# EAGLE design ESP32 Extension Board v1.0 (EAGLE 6.4)
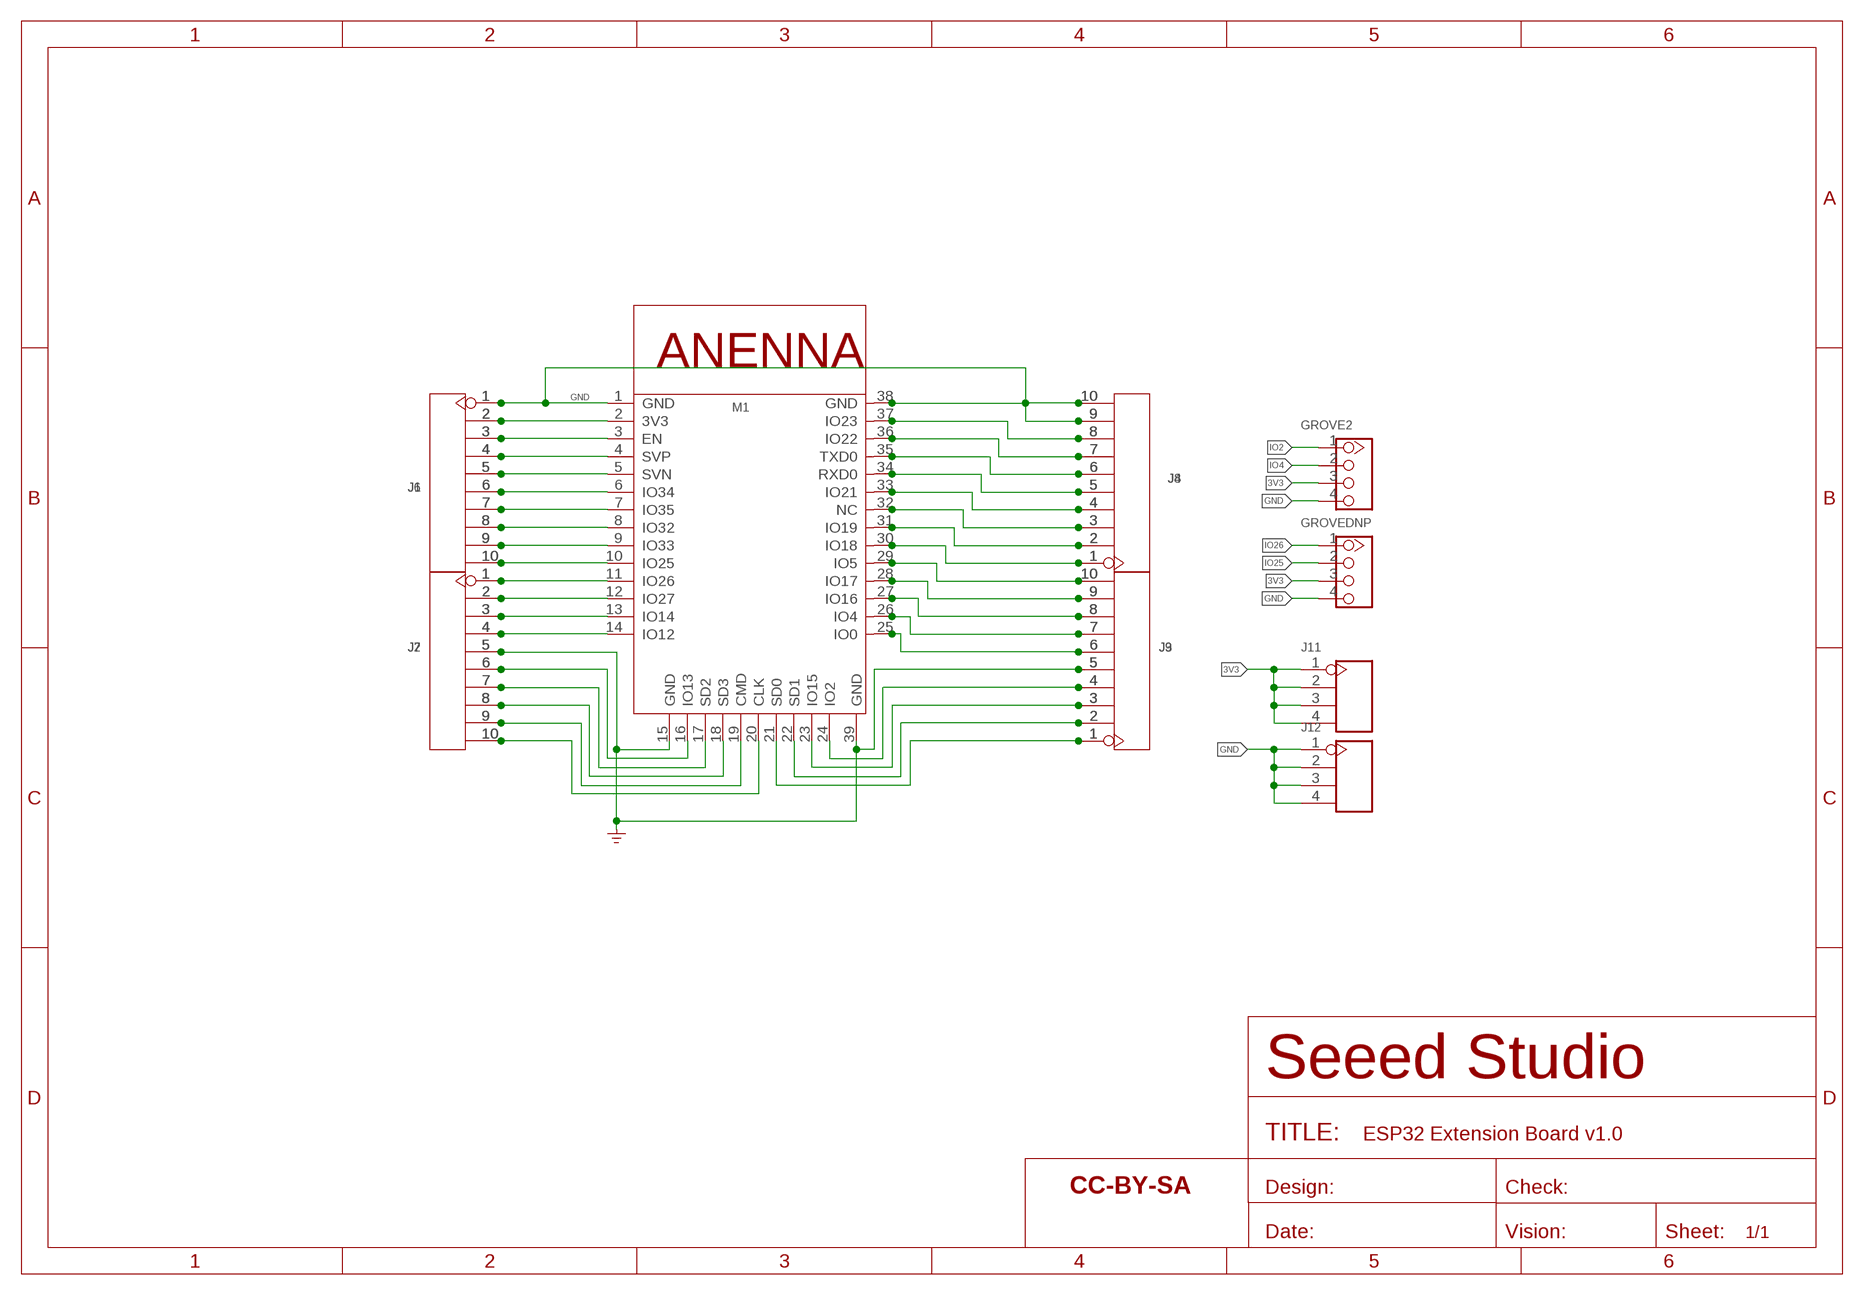
[diagram p0: schematic, sheet 1]

## Parts
FR2  SEEEDSTUDIO-OPEN-SCH-FRAME  [SEEEDSTUDIO-PCB-FRAME]
GROVE  DNP  GROVE-CONNECTOR-DIP-2.0  [HW4-2.0]
GROVE2  GROVE-CONNECTOR-DIP-2.0  [HW4-2.0]
J1  HEADER-10P-2.54  [H10-2.54]
J2  HEADER-10P-2.54  [H10-2.54]
J3  HEADER-10P-2.54  [H10-2.54]
J4  HEADER-10P-2.54  [H10-2.54]
J6  HEADER-10P-2.54  [H10-2.54]
J7  HEADER-10P-2.54  [H10-2.54]
J8  HEADER-10P-2.54  [H10-2.54]
J9  HEADER-10P-2.54  [H10-2.54]
J11  HEADER-4P-65/35MIL  [H4-2.54]
J12  HEADER-4P-65/35MIL  [H4-2.54]
M1  MODULE-WIFI-ESP-3212-38+1  [MODULE38P-1.3-18X25.5MM]

## Nets
3V3: GROVE2.3 GROVE.3 J1.2 J6.2 J11.1 J11.2 J11.3 J11.4 M1.2(3V3)
CLK: J2.10 J7.10 M1.20(CLK)
CMD: J2.9 J7.9 M1.19(CMD)
EN: J1.3 J6.3 M1.3(EN)
GND: GROVE2.4 GROVE.4 J1.1 J2.5 J3.5 J4.9 J4.10 J6.1 J7.5 J8.9 J8.10 J9.5 J12.1 J12.2 J12.3 J12.4 M1.1(GND) M1.15(GND) M1.38(GND) M1.39(GND) ; supply symbol labelled GND_POWER
IO0: J3.6 J9.6 M1.25(IO0)
IO2: GROVE2.1 J3.4 J9.4 M1.24(IO2)
IO4: GROVE2.2 J3.7 J9.7 M1.26(IO4)
IO5: J3.10 J9.10 M1.29(IO5)
IO12: J2.4 J7.4 M1.14(IO12)
IO13: J2.6 J7.6 M1.16(IO13)
IO14: J2.3 J7.3 M1.13(IO14)
IO15: J3.3 J9.3 M1.23(IO15)
IO16: J3.8 J9.8 M1.27(IO16)
IO17: J3.9 J9.9 M1.28(IO17)
IO18: J4.1 J8.1 M1.30(IO18)
IO19: J4.2 J8.2 M1.31(IO19)
IO21: J4.4 J8.4 M1.33(IO21)
IO22: J4.7 J8.7 M1.36(IO22)
IO23: J4.8 J8.8 M1.37(IO23)
IO25: GROVE.2 J1.10 J6.10 M1.10(IO25)
IO26: GROVE.1 J2.1 J7.1 M1.11(IO26)
IO27: J2.2 J7.2 M1.12(IO27)
IO32: J1.8 J6.8 M1.8(IO32)
IO33: J1.9 J6.9 M1.9(IO33)
IO34: J1.6 J6.6 M1.6(IO34)
IO35: J1.7 J6.7 M1.7(IO35)
NC: J4.3 J8.3 M1.32(NC)
RXD0: J4.5 J8.5 M1.34(RXD0)
SD0: J3.1 J9.1 M1.21(SD0)
SD1: J3.2 J9.2 M1.22(SD1)
SD2: J2.7 J7.7 M1.17(SD2)
SD3: J2.8 J7.8 M1.18(SD3)
SVN: J1.5 J6.5 M1.5(SVN)
SVP: J1.4 J6.4 M1.4(SVP)
TXD0: J4.6 J8.6 M1.35(TXD0)

## Library data of the parts
FR2 = moudle-new:SEEEDSTUDIO-OPEN-SCH-FRAME
GROVE GROVE2 = Connector-new:GROVE-CONNECTOR-DIP: 4P-2.0:320110033;4P-2.0-90D:320110034
J1-J4 J6-J9 = Connector-new:HEADER-10P
J11 J12 = Connector-new:HEADER-4P
M1 = template:MODULE-WIFI-ESP-3212

## Board
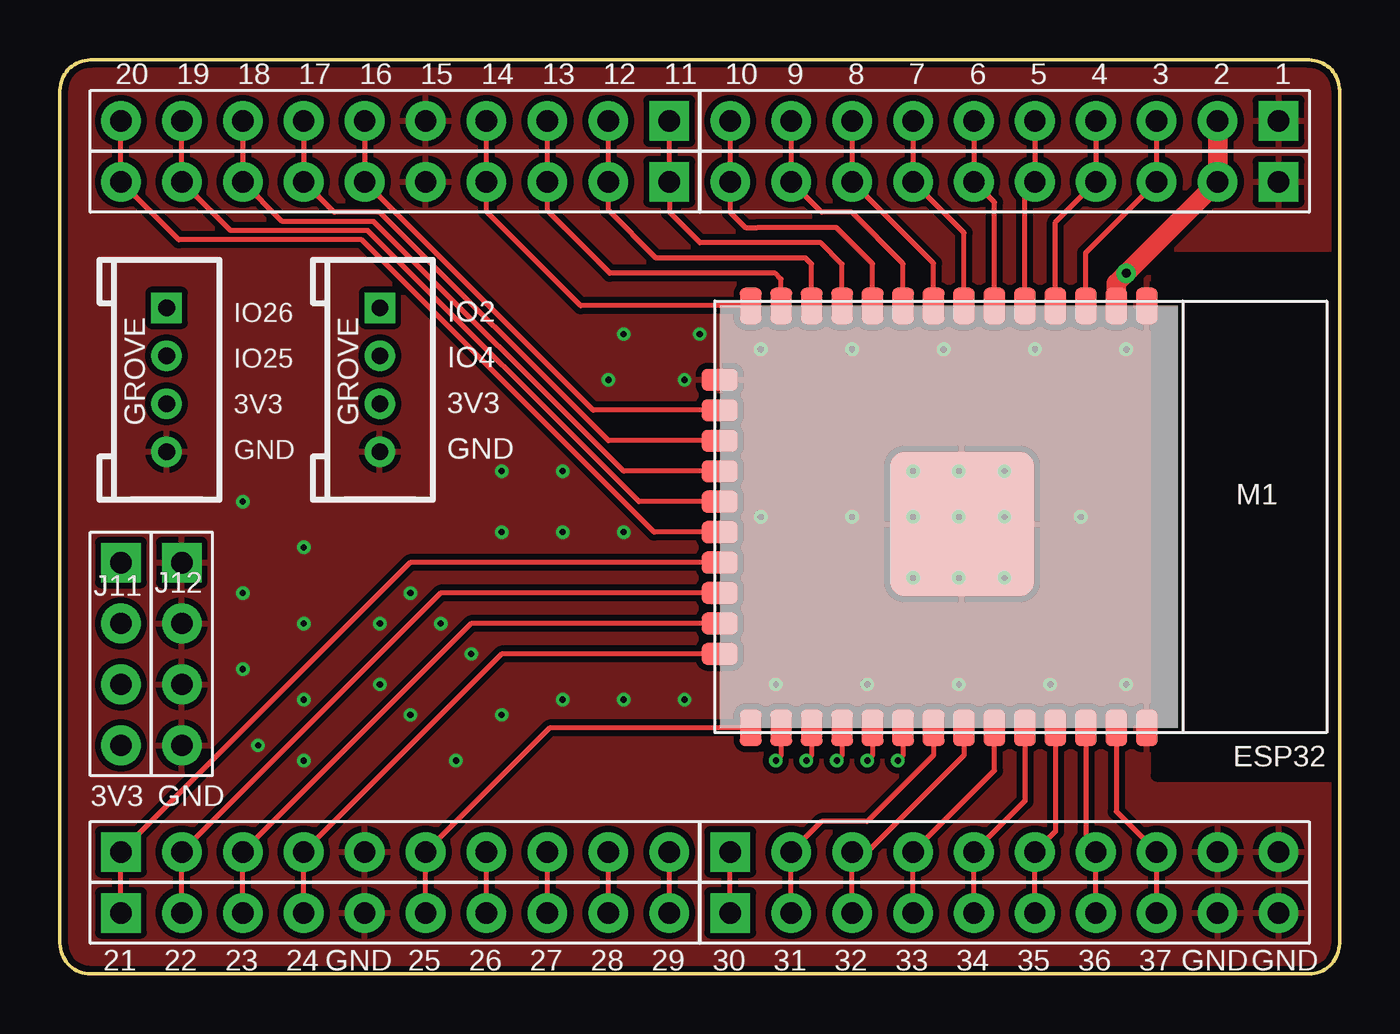
[diagram p1: board, top side]
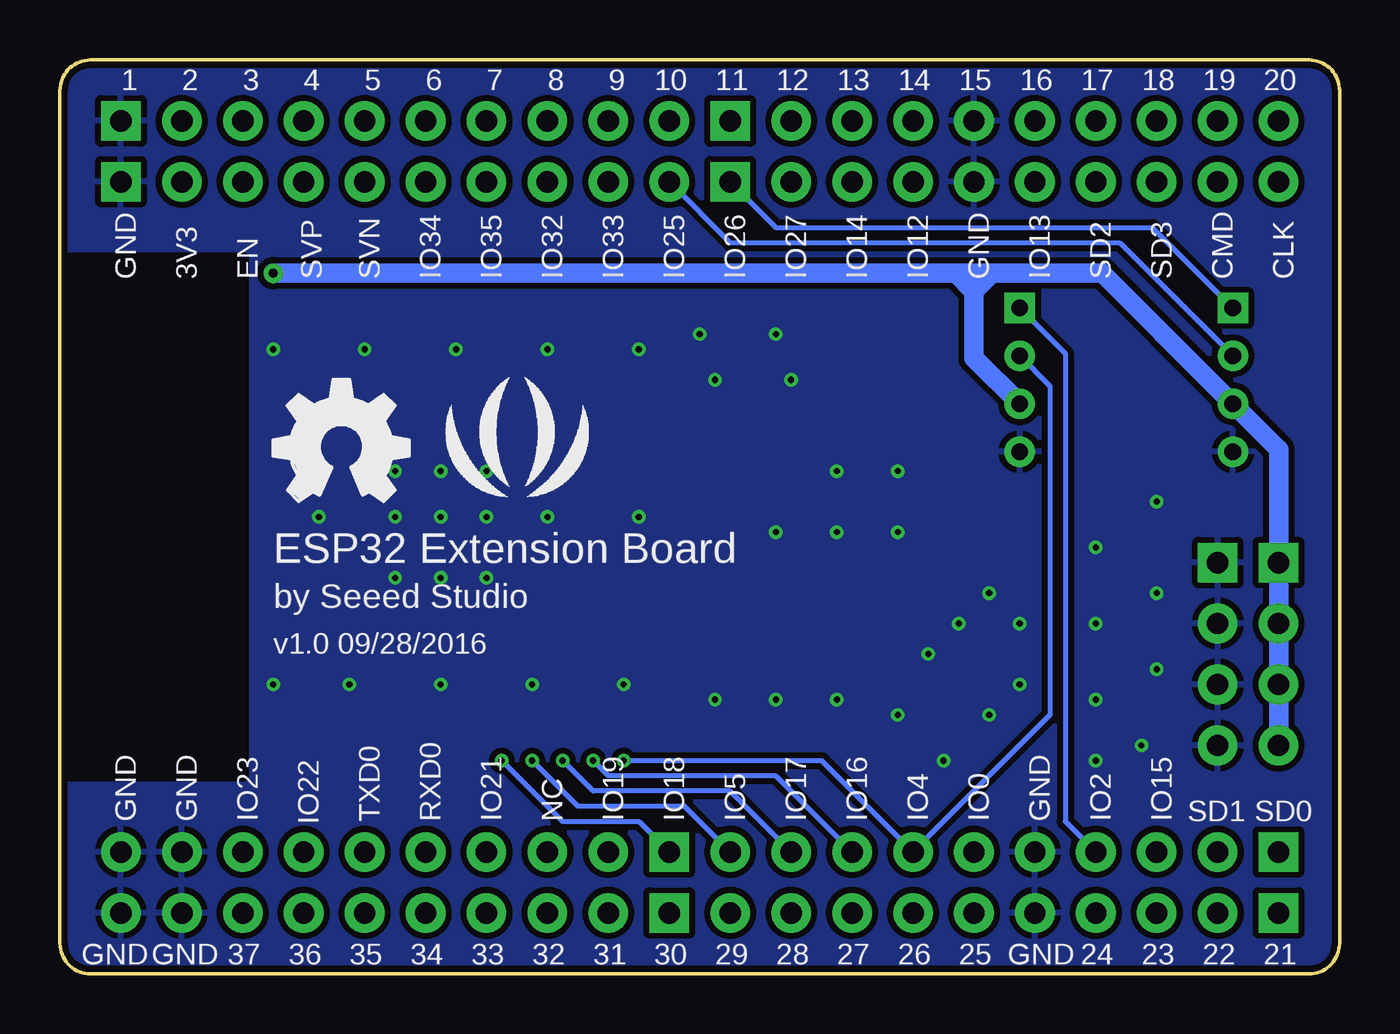
[diagram p2: board, bottom side, seen from below]

Size 53.34 x 38.1 mm. Coordinates in mm from the lower left corner, seen from the top.
Outline: 0,36.83 0,1.27 arc90 1.27,0 52.07,0 arc90 53.34,1.27 53.34,36.83 arc90 52.07,38.1 1.27,38.1 arc90 0,36.83
Copper layers (1*16): Top 0.035mm / dielectric 1.5mm / Bottom 0.035mm
Design rules "SeeedStudio_2layer_DRU_no_angle_20140221 *": minimum track width 6mil, minimum drill 10mil, track to track 6mil, track to pad 6mil, pad to pad 6mil, via to via 6mil, smd to smd 0mil, copper to edge 10mil, drill to drill 10mil, minimum pad ring 10mil, minimum via ring 6mil, stop-mask expansion 2mil, vias tented up to drill 25mil, thermal gap 10mil
tRestrict: area 45.7,8.3 to 53.2,29.8
bRestrict: area 45.7,8.3 to 53.2,29.8

### Footprints (pad centres in the part's own frame; a part is rotated, then mirrored left to right if it is on the bottom)
HW4-2.0 = drill 0.7 pad 1.27 square: 1 -3,0 | drill 0.7 pad 1.27: 2 -1,0; 3 1,0; 4 3,0
H10-2.54 = drill 0.889 pad 1.651 square: 1 0,11.43 | drill 0.889 pad 1.651: 2 0,8.89; 3 0,6.35; 4 0,3.81; 5 0,1.27; 6 0,-1.27; 7 0,-3.81; 8 0,-6.35; 9 0,-8.89; 10 0,-11.43
H4-2.54 = drill 0.889 pad 1.651 square: 1 0,3.81 | drill 0.889 pad 1.651: 2 0,1.27; 3 0,-1.27; 4 0,-3.81
MODULE38P-1.3-18X25.5MM = smd 1.5 x 0.9: 1 -8.8,18; 2 -8.8,16.73; 3 -8.8,15.46; 4 -8.8,14.19; 5 -8.8,12.92; 6 -8.8,11.65; 7 -8.8,10.38; 8 -8.8,9.11; 9 -8.8,7.84; 10 -8.8,6.57; 11 -8.8,5.3; 12 -8.8,4.03; 13 -8.8,2.76; 14 -8.8,1.49; 25 8.8,1.49; 26 8.8,2.76; 27 8.8,4.03; 28 8.8,5.3; 29 8.8,6.57; 30 8.8,7.84; 31 8.8,9.11; 32 8.8,10.38; 33 8.8,11.65; 34 8.8,12.92; 35 8.8,14.19; 36 8.8,15.46; 37 8.8,16.73; 38 8.8,18 | smd 0.9 x 1.5: 15 -5.715,0.2; 16 -4.445,0.2; 17 -3.175,0.2; 18 -1.905,0.2; 19 -0.635,0.2; 20 0.635,0.2; 21 1.905,0.2; 22 3.175,0.2; 23 4.445,0.2; 24 5.715,0.2 | smd 6 x 6: 39 0.3,10.3

### Placement (x,y rotation side)
FR2  -24.13,-41.53 0 top  (outside the outline)
GROVE  4.45,24.77 270 top
GROVE2  13.34,24.77 270 top
J1  39.37,33.02 270 top
J2  13.97,33.02 270 top
J3  13.97,5.08 90 top
J4  39.37,5.08 90 top
J6  39.37,35.56 270 top
J7  13.97,35.56 270 top
J8  39.37,2.54 90 top
J9  13.97,2.54 90 top
J11  2.54,13.34 0 top
J12  5.08,13.34 0 top
M1  27.3,19.05 270 top
U$1  [OSHW_FILLX200_NOTEXT]  44.45,19.68 0 bottom
U$3  [SEEED-SILK-280*268MIL]  34.29,21.59 0 bottom

### Tracks (layer width: path | path; a pad name or v marks a point on that pad's centre or on a via)
3V3  (via drill 0.38 pad 0.81)
  Top 0.813: M1.2 44.03,28.8 v44.45,29.21 J1.2 J6.2
  Bottom 0.813: v44.45,29.21 16,29.21 | 16,29.21 15.24,29.21 | 14.48,29.21 9.89,29.21 GROVE.3 | GROVE.3 2.54,21.86 J11.1 J11.2 J11.3 J11.4 | GROVE.3 4.46,23.77 7.37,26.67 | 15.24,29.21 15.24,28.45 | 15.24,28.45 15.24,25.67 GROVE2.3 | 14.48,29.21 15.24,28.45 | 15.24,28.45 16,29.21 | 14.48,29.21 15.24,29.21
CLK
  Top 0.203: M1.20 24.77,18.41 12.57,30.61 4.95,30.61 J2.10 J7.10
CMD
  Top 0.203: M1.19 24.13,19.68 12.83,30.99 7.11,30.99 J2.9 J7.9
EN
  Top 0.203: M1.3 42.77,30.07 J1.3 J6.3
GND  (via drill 0.25 pad 0.51)
  other vias: 26.04,24.77 22.86,24.77 23.5,26.67 26.67,26.67 16.51,8.89 18.41,10.79 20.95,11.43 23.5,11.43 26.04,11.43 23.5,18.41 20.95,18.41 18.41,18.41 18.41,20.95 20.95,20.95 13.34,12.06 15.88,14.61 17.14,13.34 14.61,10.79 14.61,15.88 13.34,14.61 10.16,11.43 8.26,9.53 10.16,8.89 35.56,20.95 37.47,20.95 39.37,20.95 37.47,16.51 37.47,19.05 35.56,16.51 35.56,19.05 39.37,19.05 39.37,16.51 29.84,12.06 33.66,12.06 37.47,12.06 41.27,12.06 44.45,12.06 29.21,26.04 33.02,26.04 36.83,26.04 40.64,26.04 44.45,26.04 29.21,19.05 33.02,19.05 42.55,19.05 7.62,12.7 7.62,15.88 7.62,19.68 10.16,17.78 10.16,14.61
  pour Bottom (isolate 0.254): 0,0 53.98,0 53.98,38.1 0,38.1
  pour Top (isolate 0.254): 0,0 53.98,0 53.98,38.1 0,38.1
IO0
  Top 0.203: J9.6 J3.6 20.41,10.25 M1.25
IO2
  Top 0.203: M1.24 18.41,13.34 J3.4 J9.4
  Bottom 0.203: GROVE2.1 11.43,25.86 11.43,6.35 J3.4
IO4  (via drill 0.25 pad 0.51)
  Top 0.203: J9.7 J3.7 | M1.26 30.07,9.11 v29.84,8.89
  Bottom 0.203: GROVE2.2 12.06,24.5 12.06,10.79 J3.7 21.59,8.89 v29.84,8.89
IO5  (via drill 0.25 pad 0.51)
  Top 0.203: J9.10 J3.10 | M1.29 33.88,9.11 v33.66,8.89
  Bottom 0.203: J3.10 27.3,6.99 31.75,6.99 v33.66,8.89
IO12
  Top 0.203: J7.4 J2.4 17.78,31.78 21.71,27.85 M1.14
IO13
  Top 0.203: M1.16 22.23,23.5 J2.6 J7.6
IO14
  Top 0.203: J7.3 J2.3 20.32,31.82 22.93,29.21 29.82,29.21 30.07,28.96 M1.13
IO15
  Top 0.203: M1.23 17.14,14.61 J3.3 J9.3
IO16  (via drill 0.25 pad 0.51)
  Top 0.203: J9.8 J3.8 | M1.27 31.34,9.11 v31.11,8.89
  Bottom 0.203: J3.8 23.5,8.26 30.48,8.26 v31.11,8.89
IO17  (via drill 0.25 pad 0.51)
  Top 0.203: J9.9 J3.9 | M1.28 32.6,9.11 v32.38,8.89
  Bottom 0.203: J3.9 25.4,7.62 31.11,7.62 v32.38,8.89
IO18  (via drill 0.25 pad 0.51)
  Top 0.203: J8.1 J4.1 | M1.30 35.15,9.11 v34.92,8.89
  Bottom 0.203: v34.92,8.89 32.38,6.35 29.21,6.35 J4.1
IO19
  Top 0.203: J8.2 J4.2 31.75,6.35 33.66,6.35 36.41,9.11 M1.31
IO21
  Top 0.203: J8.4 J4.4 38.95,8.47 M1.33
IO22
  Top 0.203: M1.36 42.77,5.5 J4.7 J8.7
IO23
  Top 0.203: M1.37 44.03,6.76 J4.8 J8.8
IO25
  Top 0.203: J6.10 J1.10 27.94,31.75 28.57,31.11 29.08,31.11 29.21,31.11 32.37,31.11 33.88,29.61 M1.10
  Bottom 0.203: J1.10 25.4,30.48 9.16,30.48 GROVE.2
IO26
  Top 0.203: J7.1 J2.1 25.4,31.75 26.67,30.48 31.72,30.48 32.6,29.59 M1.11
  Bottom 0.203: J2.1 23.5,31.11 7.79,31.11 GROVE.1
IO27
  Top 0.203: J7.2 J2.2 22.86,31.83 24.84,29.84 31.08,29.84 31.34,29.59 M1.12
IO32
  Top 0.203: M1.8 36.41,29.62 J1.8 J6.8
IO33
  Top 0.203: J6.9 J1.9 31.75,31.75 33,31.75 35.15,29.61 M1.9
IO34
  Top 0.203: M1.6 38.95,32.16 J1.6 J6.6
IO35
  Top 0.203: M1.7 37.69,30.89 J1.7 J6.7
NC
  Top 0.203: J8.3 J4.3 33.66,5.08 34.92,6.35 34.99,6.41 37.56,8.98 37.69,9.11 M1.32
RXD0
  Top 0.203: J8.5 J4.5 40.23,7.21 M1.34
SD0
  Top 0.203: M1.21 14.61,17.14 2.6,5.14 J3.1 J9.1
SD1
  Top 0.203: M1.22 15.88,15.88 J3.2 J9.2
SD2
  Top 0.203: M1.17 22.86,22.23 13.34,31.75 11.43,31.75 J2.7 J7.7
SD3
  Top 0.203: M1.18 23.5,20.95 13.08,31.37 9.27,31.37 J2.8 J7.8
SVN
  Top 0.203: M1.5 40.23,32.6 J1.5 J6.5
SVP
  Top 0.203: M1.4 41.49,31.34 J1.4 J6.4
TXD0
  Top 0.203: M1.35 41.49,5.93 J4.6 J8.6

### Text on the board
tPlace: 20 | 19 | 18 | 17 | 16 | 15 | 14 | 13 | 12 | 11 | 10 | 9 | 8 | 7 | 6 | 5 | 4 | 3 | 2 | 1 | IO26 | IO2 | IO25 | IO4 | 3V3 | GROVE | 3V3 | GND | GND | ESP32 | 3V3 | GND | 21 | 22 | 23 | 24 | GND | 25 | 26 | 27 | 28 | 29 | 30 | 31 | 32 | 33 | 34 | 35 | 36 | 37 | GND | GND
bPlace: 20 | 19 | 18 | 17 | 16 | 15 | 14 | 13 | 12 | 11 | 10 | 9 | 8 | 7 | 6 | 5 | 4 | 3 | 2 | 1 | CLK | CMD | SD3 | SD2 | IO13 | GND | IO12 | IO14 | IO27 | IO26 | IO25 | IO33 | IO32 | IO35 | IO34 | SVN | SVP | EN | 3V3 | GND | ESP32 Extension Board | by Seeed Studio | v1.0 09/28/2016 | SD0 | SD1 | IO15 | IO2 | GND | IO0 | IO4 | IO16 | IO17 | IO5 | IO18 | IO19 | NC | IO21 | RXD0 | TXD0 | IO22 | IO23 | GND | GND | 21 | 22 | 23 | 24 | GND | 25 | 26 | 27 | 28 | 29 | 30 | 31 | 32 | 33 | 34 | 35 | 36 | 37 | GND | GND